# Altium schematic sheet Analog_Front_End.SchDoc
size A4; SheetNumber: 1; SheetTotal: 4
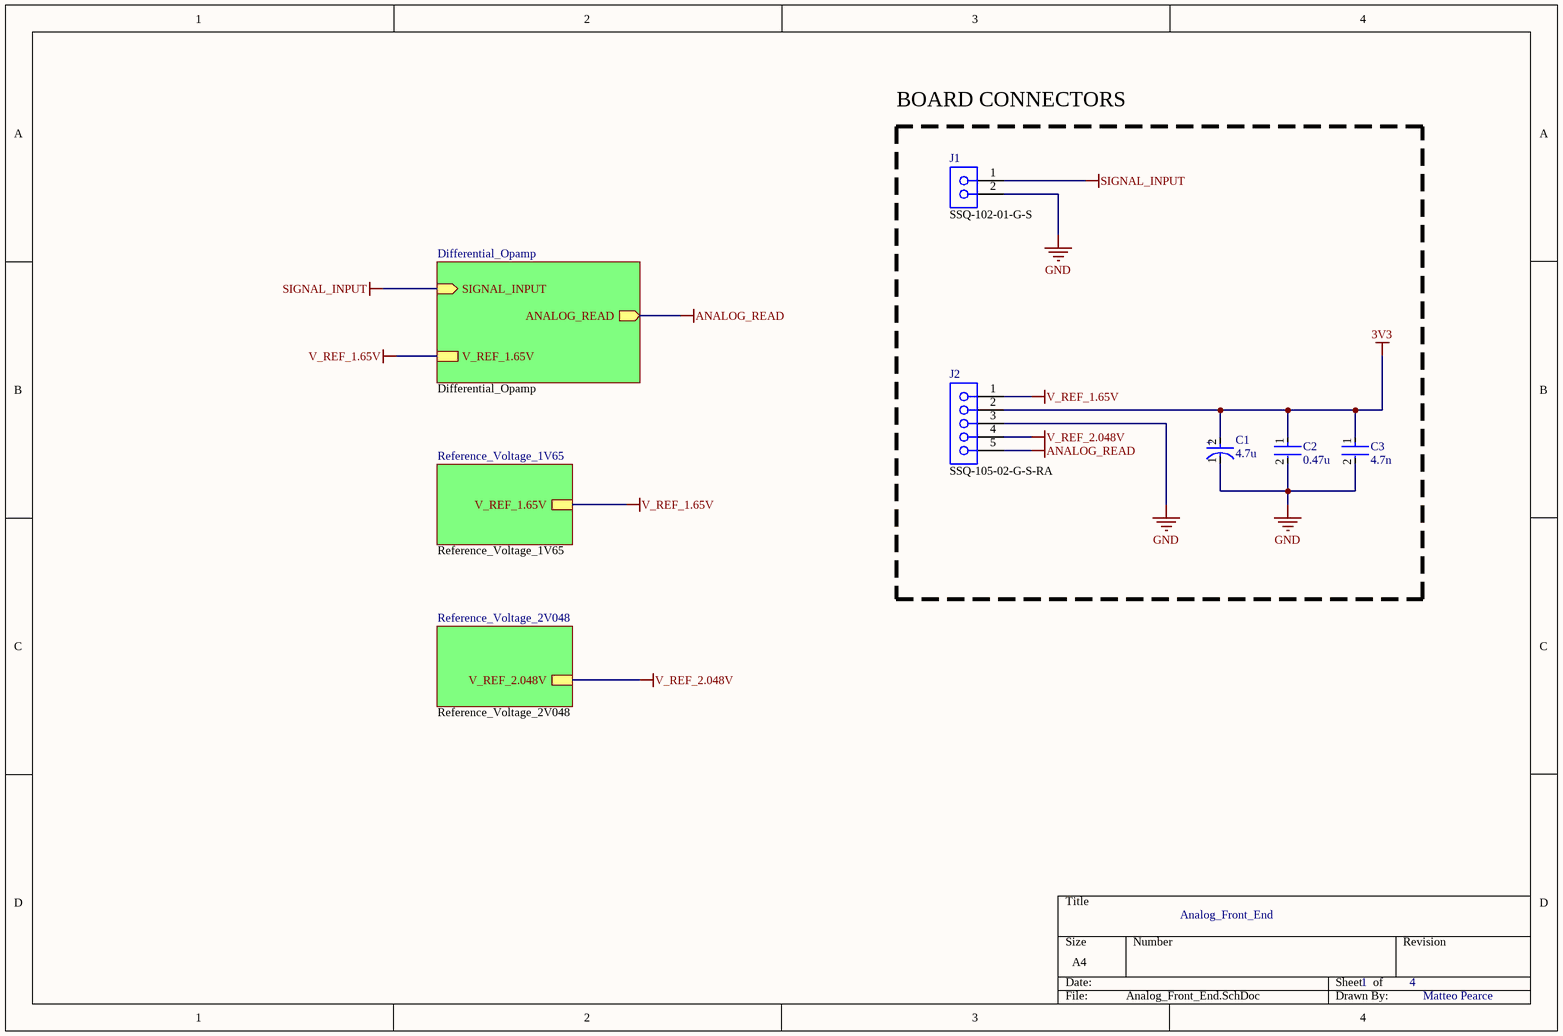
[diagram p0: Analog_Front_End.SchDoc]

## Parts
C1  4.7u  [FP-TAJA-MFG]
C2  0.47u  [FP-GCM188-0_1-IPC_A]
C3  4.7n  [FP-CC0805-0_85-MFG]
J1  SSQ-102-01-G-S  [SMTC-SSQ-102-01-X-S]
J2  SSQ-105-02-G-S-RA  [SMTC-SSQ-105-02-X-S-RA]

## Blocks framed on the sheet
BOARD CONNECTORS: C1-C3 J1 J2

## Sub-sheets
Differential_Opamp = Differential_Opamp: ANALOG_READ (out), SIGNAL_INPUT (in), V_REF_1.65V
Reference_Voltage_1V65 = Reference_Voltage_1V65: V_REF_1.65V
Reference_Voltage_2V048 = Reference_Voltage_2V048: V_REF_2.048V

## Nets
3V3: C1.2(A) C2.1 C3.1 J2.2
ANALOG_READ: J2.5 ; sheet Differential_Opamp/ANALOG_READ
GND: C1.1(C) C2.2 C3.2 J1.2 J2.3
SIGNAL_INPUT: J1.1 ; sheet Differential_Opamp/SIGNAL_INPUT
V_REF_1.65V: J2.1 ; sheet Reference_Voltage_1V65/V_REF_1.65V, sheet Differential_Opamp/V_REF_1.65V
V_REF_2.048V: J2.4 ; sheet Reference_Voltage_2V048/V_REF_2.048V

## Notes on the sheet
- Analog_Front_End
- 1
- 4
- Matteo Pearce
- (in symbol CMP-04424-000323-2) +

## Library data of the parts
C1 = CMP-04424-000323-2: 4.7uF 20V  ±10% 4Ω 1206  SMD Tantalum Capacitor; NexarPartId: 39985789; Q Factor: 6; Ripple Current: 137mA; Life (Hours): 2000hours; Dissipation Factor: 6%; Capacitance: 4.7µF; Leakage Current: 900nA; Polarity: Polar; Case Code (Imperial): 1206; Min Operating Temperature: -55°C; Length: 3.2mm; Lead Free: Lead Free; Width: 1.6mm; REACH SVHC: No SVHC; ESR (Equivalent Series Resistance): 4Ω; Lead Pitch: 1.1mm; RoHS: Compliant; Voltage Rating: 20V; Packaging: Cut Tape (CT); Height: 1.6mm; Dielectric Material: Tantalum; Voltage Rating (DC): 20V; Number of Pins: 2; Max Operating Temperature: 125°C; Height - Seated (Max): 1.8034mm; Schedule B: 8532210050; Lifecycle Status: Production; Depth: 1.6mm; Radiation Hardening: No; Case/Package: 1206; Features: General Purpose; Case Code (Metric): 3216; Tolerance: 10%; Termination: SMD/SMT; Voltage: 20V; Mount: PCB, Surface Mount
C2 = CMP-2006-02360-2: Ceramic Capacitor for Automotive 470nF  ±10% 16VDC X7R 0603 Paper T/R; Voltage: 16V; Max Operating Temperature: 125°C; Lead Free: Lead Free; Termination: SMD/SMT; Packaging: Tape and Reel; Width: 0.8mm; Mount: Surface Mount; Height: 0.8mm; Package Quantity: 1; Voltage Rating (DC): 16V; Length: 1.6mm; Dielectric: X7R; Case/Package: 0603; Voltage Rating: 16V; REACH SVHC: No SVHC; Thickness: 0.035inch; Min Operating Temperature: -55°C; Tolerance: 10%; Capacitance: 470nF; Depth: 0.8mm; Radiation Hardening: No; Case Code (Metric): 1608; Case Code (Imperial): 0603; Ratings: AEC-Q200
C3 = CMP-03422-000052-1: CAP CER 0.047UF 50V X7R 0805; Manufacturer Part Number: CC0805KRX7R9BB473; Manufacturer: Yageo; Description: CC0805 47 nF X7R 10.00% 50 V; Value: 47 nF; Tolerance: 0.1; Material: Ceramic; Footprint Url: http://www.yageo.com/exep/pages/download/literatures/UPY-C_GEN_24.pdf; ComponentLink2URL: http://www.yageo.com/documents/recent/UPY-GPHC_Y5V_6.3V-to-50V_8.pdf; Ipc Land Pattern Name: CAPC200125X85; Digikey Description: CAP CER 0.047UF 50V X7R 0805; Lead Free: Yes; Octopart: https://octopart.com/cc0805krx7r9bb473-yageo-42181304; Voltage Rating: 50 V; RoHS: TRUE; ComponentLink2Description: Datasheet; Temperature Range High: +85°C; Package: CC0805-0.85; Temperature Range Low: -30°C; Device Class L2: Capacitors; Device Class L3: Ceramic Capacitors; Height: 0.95mm; Temperature: -30°C to +85°C; Category: Cap; Device Class L1: Passive Components; Capacitance: 47 nF; Temperature Characteristic: X7R; Automotive: No; Mouser Description: Multilayer Ceramic Capacitors MLCC - SMD/SMT 47nF 50V X7R 10%
J1 = CMP-1023-00275-1: SQ Post Socket, Through-hole, Vertical, -55 to 125 degC, 2.54 mm Pitch, 2-Pin, Female, RoHS; Manufacturer: Samtec; Pitch: 2.54 mm; ComponentLink1URL: http://www.samtec.com; ComponentLink3URL: http://www.samtec.com/documents/webfiles/cpdf/SSQ-1XX-XX-XXX-X-XX-XXX-XX-X-MKT.pdf; Temperature Range: -55 to 125 degC; PackageDescription: Assembly, Socket Strip .025[0.64] SQ Tail; RoHS: True; PackageVersion: BD, 6/1987; ComponentLink3Description: Package Specification; PackageReference: SSQ-102-01-X-S; ComponentLink2Description: Datasheet; ComponentLink2URL: http://www.samtec.com/documents/webfiles/pdf/SSQ_TH.PDF; ComponentLink1Description: Manufacturer URL; DatasheetVersion: F-214; Orientation: Vertical; Mounting Technology: Through-hole; PartNumber: SSQ-102-01-G-S
J2 = CMP-1023-00280-1: SQ Post Socket, Through-hole, Right Angle, -55 to 125 degC, 2.54 mm Pitch, 5-Pin, Female, RoHS; Manufacturer: Samtec; Pitch: 2.54 mm; DatasheetVersion: F-214; ComponentLink3Description: Package Specification; ComponentLink1URL: http://www.samtec.com; PackageReference: SSQ-105-02-X-S-RA; Temperature Range: -55 to 125 degC; ComponentLink1Description: Manufacturer URL; ComponentLink2Description: Datasheet; ComponentLink3URL: http://www.samtec.com/documents/webfiles/cpdf/SSQ-1XX-XX-XXX-X-XX-XXX-XX-X-MKT.pdf; PartNumber: SSQ-105-02-G-S-RA; PackageVersion: BD, 6/1987; PackageDescription: Assembly, Socket Strip .025[0.64] SQ Tail; Orientation: Right Angle; Mounting Technology: Through-hole; RoHS: True; ComponentLink2URL: http://www.samtec.com/documents/webfiles/pdf/SSQ_TH.PDF